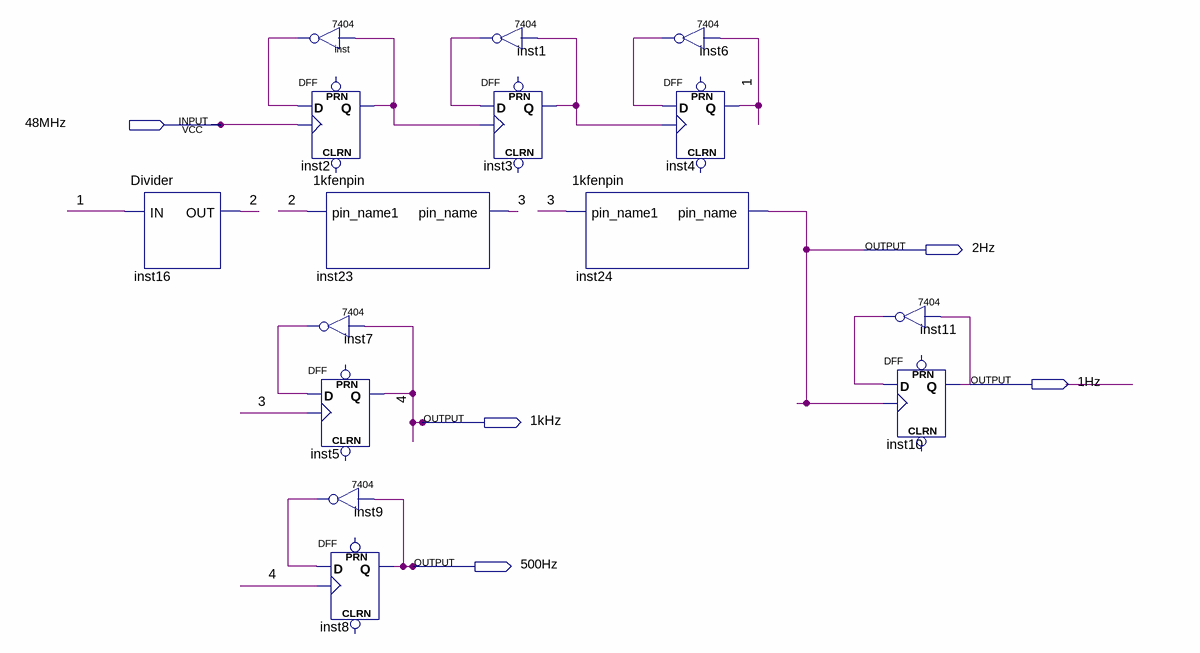
[diagram p0: schematic sheet]
// Quartus schematic FENPINQI.bdf as structural Verilog: 15 symbols, 5 pins
module FENPINQI (
  input  \48MHz ,
  output \2Hz ,
  output \1Hz ,
  output \1kHz ,
  output \500Hz 
);

  wire \1 , \2 , \3 , inst1_1, inst2_q, inst3_q, inst6_1, inst7_1, inst9_1, inst11_1, inst_1;

  Divider inst16 (.IN(\1 ), .OUT(\2 ));
  \7404  inst (.\2 (inst2_q), .\1 (inst_1));
  DFF inst2 (.CLK(\48MHz ), .D(inst_1), .Q(inst2_q));  // open: CLRN, PRN
  \1kfenpin  inst23 (.pin_name1(\2 ), .pin_name(\3 ));
  \7404  inst7 (.\2 (\1kHz ), .\1 (inst7_1));
  DFF inst5 (.CLK(\3 ), .D(inst7_1), .Q(\1kHz ));  // open: CLRN, PRN
  \7404  inst9 (.\2 (\500Hz ), .\1 (inst9_1));
  DFF inst8 (.CLK(\1kHz ), .D(inst9_1), .Q(\500Hz ));  // open: CLRN, PRN
  \7404  inst1 (.\2 (inst3_q), .\1 (inst1_1));
  DFF inst3 (.CLK(inst2_q), .D(inst1_1), .Q(inst3_q));  // open: CLRN, PRN
  \1kfenpin  inst24 (.pin_name1(\3 ), .pin_name(\2Hz ));
  \7404  inst6 (.\2 (\1 ), .\1 (inst6_1));
  DFF inst4 (.CLK(inst3_q), .D(inst6_1), .Q(\1 ));  // open: CLRN, PRN
  \7404  inst11 (.\2 (\1Hz ), .\1 (inst11_1));
  DFF inst10 (.CLK(\2Hz ), .D(inst11_1), .Q(\1Hz ));  // open: CLRN, PRN

  // Other names for the same wires on the sheet: 4 = \1kHz 
endmodule
